# Altium project mdriver2_control.PrjPcb (part 2 of 2)

## Sheet analog.SchDoc
size A4; SheetNumber: 5; SheetTotal: 6
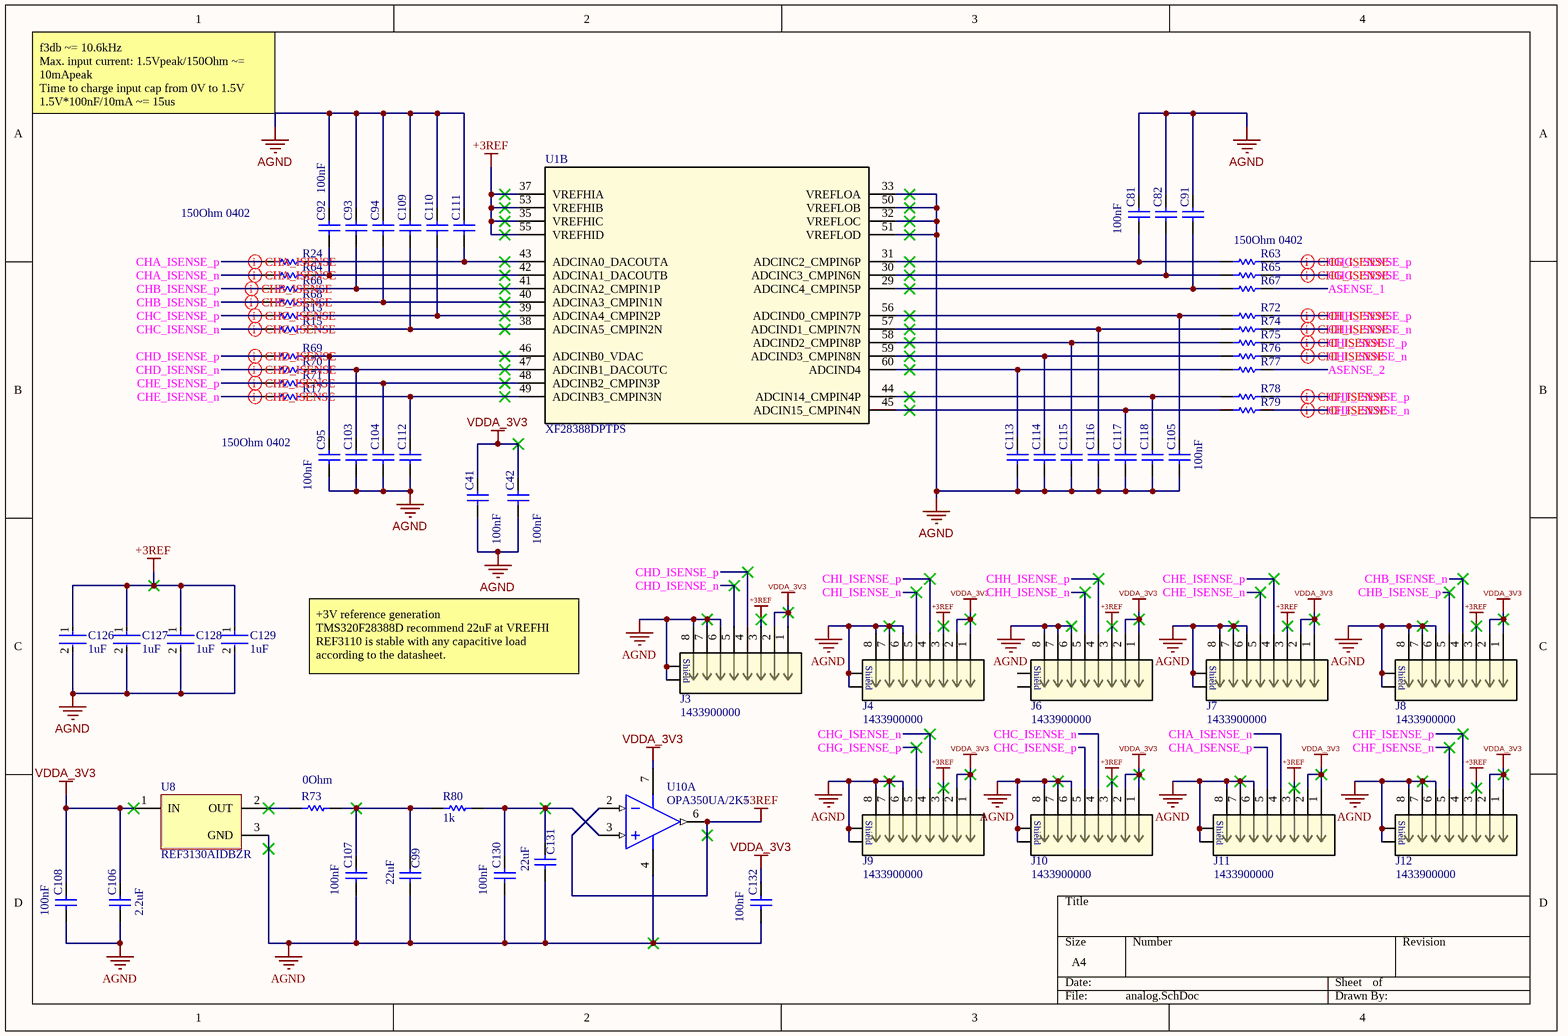
[diagram p4: analog.SchDoc]

### Parts
C41  100nF  [CAP 0402_1005]
C42  100nF  [CAP 0402_1005]
C81  100nF  [CAP 0402_1005]
C82  100nF  [CAP 0402_1005]  (value not drawn)
C91  100nF  [CAP 0402_1005]  (value not drawn)
C92  100nF  [CAP 0402_1005]
C93  100nF  [CAP 0402_1005]  (value not drawn)
C94  100nF  [CAP 0402_1005]  (value not drawn)
C95  100nF  [CAP 0402_1005]
C99  22uF  [CAP 0805_2012]
C103  100nF  [CAP 0402_1005]  (value not drawn)
C104  100nF  [CAP 0402_1005]  (value not drawn)
C105  100nF  [CAP 0402_1005]
C106  2.2uF  [CAP 0603_1608]
C107  100nF  [CAP 0402_1005]
C108  100nF  [CAP 0402_1005]
C109  100nF  [CAP 0402_1005]  (value not drawn)
C110  100nF  [CAP 0402_1005]  (value not drawn)
C111  100nF  [CAP 0402_1005]  (value not drawn)
C112  100nF  [CAP 0402_1005]  (value not drawn)
C113  100nF  [CAP 0402_1005]  (value not drawn)
C114  100nF  [CAP 0402_1005]  (value not drawn)
C115  100nF  [CAP 0402_1005]  (value not drawn)
C116  100nF  [CAP 0402_1005]  (value not drawn)
C117  100nF  [CAP 0402_1005]  (value not drawn)
C118  100nF  [CAP 0402_1005]  (value not drawn)
C126  1uF  [FP-C0402C105K8PACTU-MFG]
C127  1uF  [FP-C0402C105K8PACTU-MFG]
C128  1uF  [FP-C0402C105K8PACTU-MFG]
C129  1uF  [FP-C0402C105K8PACTU-MFG]
C130  100nF  [CAP 0402_1005]
C131  22uF  [CAP 0805_2012]
C132  100nF  [CAP 0402_1005]
J3  1433900000  [CONN8_1433900000_WED]
J4  1433900000  [CONN8_1433900000_WED]
J6  1433900000  [CONN8_1433900000_WED]
J7  1433900000  [CONN8_1433900000_WED]
J8  1433900000  [CONN8_1433900000_WED]
J9  1433900000  [CONN8_1433900000_WED]
J10  1433900000  [CONN8_1433900000_WED]
J11  1433900000  [CONN8_1433900000_WED]
J12  1433900000  [CONN8_1433900000_WED]
R13  150Ohm 0402  [RESC1005X40X25LL05T10]  (value not drawn)
R15  150Ohm 0402  [RESC1005X40X25LL05T10]  (value not drawn)
R17  150Ohm 0402  [RESC1005X40X25LL05T10]  (value not drawn)
R24  150Ohm 0402  [RESC1005X40X25LL05T10]  (value not drawn)
R63  150Ohm 0402  [RESC1005X40X25LL05T10]
R64  150Ohm 0402  [RESC1005X40X25LL05T10]
R65  150Ohm 0402  [RESC1005X40X25LL05T10]  (value not drawn)
R66  150Ohm 0402  [RESC1005X40X25LL05T10]  (value not drawn)
R67  150Ohm 0402  [RESC1005X40X25LL05T10]  (value not drawn)
R68  150Ohm 0402  [RESC1005X40X25LL05T10]  (value not drawn)
R69  150Ohm 0402  [RESC1005X40X25LL05T10]
R70  150Ohm 0402  [RESC1005X40X25LL05T10]  (value not drawn)
R71  150Ohm 0402  [RESC1005X40X25LL05T10]  (value not drawn)
R72  150Ohm 0402  [RESC1005X40X25LL05T10]  (value not drawn)
R73  0Ohm  [RES 0603_1608]
R74  150Ohm 0402  [RESC1005X40X25LL05T10]  (value not drawn)
R75  150Ohm 0402  [RESC1005X40X25LL05T10]  (value not drawn)
R76  150Ohm 0402  [RESC1005X40X25LL05T10]  (value not drawn)
R77  150Ohm 0402  [RESC1005X40X25LL05T10]  (value not drawn)
R78  150Ohm 0402  [RESC1005X40X25LL05T10]  (value not drawn)
R79  150Ohm 0402  [RESC1005X40X25LL05T10]  (value not drawn)
R80  1k  [RES 0402_1005]
U1  XF28388DPTPS  [PTP0176F-IPC_A]  (part B of 5)
U8  REF3130AIDBZR  [DBZ0003A_N]
U10  OPA350UA/2K5  [D0008A_N]  (part A of 2)

### Nets
+3REF: C126.1 C127.1 C128.1 C129.1 J3.3 J4.3 J6.3 J7.3 J8.3 J9.3 J10.3 J11.3 J12.3 U1.35(VREFHIC) U1.37(VREFHIA) U1.53(VREFHIB) U1.55(VREFHID) U10.2(IN-) U10.6(OUT)
AGND: C41.1 C42.1 C81.2 C82.2 C91.2 C92.2 C93.2 C94.2 C95.1 C99.1 C103.1 C104.1 C105.1 C106.1 C107.1 C108.1 C109.2 C110.2 C111.2 C112.1 C113.1 C114.1 C115.1 C116.1 C117.1 C118.1 C126.2 C127.2 C128.2 C129.2 C130.1 C131.1 C132.1 J3.6 J3.7 J3.8 J3.9 J3.10(SHLD) J4.6 J4.7 J4.8 J4.9 J4.10(SHLD) J6.6 J6.7 J6.8 J7.6 J7.7 J7.8 J7.9 J7.10(SHLD) J8.6 J8.7 J8.8 J8.9 J8.10(SHLD) J9.6 J9.7 J9.8 J9.9 J9.10(SHLD) J10.6 J10.7 J10.8 J10.9 J10.10(SHLD) J11.6 J11.7 J11.8 J11.9 J11.10(SHLD) J12.6 J12.7 J12.8 J12.9 J12.10(SHLD) U1.32(VREFLOC) U1.33(VREFLOA) U1.50(VREFLOB) U1.51(VREFLOD) U8.3(GND) U10.4(V-)
VDDA_3V3: C41.2 C42.2 C106.2 C108.2 C132.2 J3.1 J3.2 J4.1 J4.2 J6.1 J6.2 J7.1 J7.2 J8.1 J8.2 J9.1 J9.2 J10.1 J10.2 J11.1 J11.2 J12.1 J12.2 U8.1(IN) U10.7(V+)
ASENSE_1: R67.2
ASENSE_2: R77.2
CHA_ISENSE_n: J11.4 R64.1
CHA_ISENSE_p: J11.5 R24.1
CHB_ISENSE_n: J8.4 R68.1
CHB_ISENSE_p: J8.5 R66.1
CHC_ISENSE_n: J10.4 R15.1
CHC_ISENSE_p: J10.5 R13.1
CHD_ISENSE_n: J3.5 R70.1
CHD_ISENSE_p: J3.4 R69.1
CHE_ISENSE_n: J7.5 R17.1
CHE_ISENSE_p: J7.4 R71.1
CHF_ISENSE_n: J12.5 R79.2
CHF_ISENSE_p: J12.4 R78.2
CHG_ISENSE_n: J9.4 R65.2
CHG_ISENSE_p: J9.5 R63.2
CHH_ISENSE_n: J6.5 R74.2
CHH_ISENSE_p: J6.4 R72.2
CHI_ISENSE_n: J4.5 R76.2
CHI_ISENSE_p: J4.4 R75.2
NetC81_1: C81.1 R63.1 U1.31(ADCINC2_CMPIN6P)
NetC82_1: C82.1 R65.1 U1.30(ADCINC3_CMPIN6N)
NetC91_1: C91.1 R67.1 U1.29(ADCINC4_CMPIN5P)
NetC92_1: C92.1 R64.2 U1.42(ADCINA1_DACOUTB)
NetC93_1: C93.1 R66.2 U1.41(ADCINA2_CMPIN1P)
NetC94_1: C94.1 R68.2 U1.40(ADCINA3_CMPIN1N)
NetC95_2: C95.2 R69.2 U1.46(ADCINB0_VDAC)
NetC99_2: C99.2 C107.2 R73.2 R80.1
NetC103_2: C103.2 R70.2 U1.47(ADCINB1_DACOUTC)
NetC104_2: C104.2 R71.2 U1.48(ADCINB2_CMPIN3P)
NetC105_2: C105.2 R72.1 U1.56(ADCIND0_CMPIN7P)
NetC109_1: C109.1 R15.2 U1.38(ADCINA5_CMPIN2N)
NetC110_1: C110.1 R13.2 U1.39(ADCINA4_CMPIN2P)
NetC111_1: C111.1 R24.2 U1.43(ADCINA0_DACOUTA)
NetC112_2: C112.2 R17.2 U1.49(ADCINB3_CMPIN3N)
NetC113_2: C113.2 R77.1 U1.60(ADCIND4)
NetC114_2: C114.2 R76.1 U1.59(ADCIND3_CMPIN8N)
NetC115_2: C115.2 R75.1 U1.58(ADCIND2_CMPIN8P)
NetC116_2: C116.2 R74.1 U1.57(ADCIND1_CMPIN7N)
NetC117_2: C117.2 R79.1 U1.45(ADCIN15_CMPIN4N)
NetC118_2: C118.2 R78.1 U1.44(ADCIN14_CMPIN4P)
NetC130_2: C130.2 C131.2 R80.2 U10.3(IN+)
NetR73_1: R73.1 U8.2(OUT)

Not connected (* = marked no-connect by the designer): J6 9 10(SHLD)

### Layout directives
differential pair: CHA_ISENSE_n, CHA_ISENSE_p, CHB_ISENSE_n, CHB_ISENSE_p, CHC_ISENSE_n, CHC_ISENSE_p, CHD_ISENSE_n, CHD_ISENSE_p, CHE_ISENSE_n, CHE_ISENSE_p, CHF_ISENSE_n, CHF_ISENSE_p, CHG_ISENSE_n, CHG_ISENSE_p, CHH_ISENSE_n, CHH_ISENSE_p, CHI_ISENSE_n, CHI_ISENSE_p

### Notes on the sheet
- f3db ~= 10.6kHz
  Max. input current: 1.5Vpeak/150Ohm ~= 10mApeak
  Time to charge input cap from 0V to 1.5V
  1.5V*100nF/10mA ~= 15us
- +3V reference generation
  TMS320F28388D recommend 22uF at VREFHI
  REF3110 is stable with any capacitive load according to the datasheet.
- (in symbol 1433900000) Shield

### Library data of the parts
C41 C42 C81 C82 C91-C95 C103-C105 C107-C118 C130 C132 = Cap: MLCC 100nF 0402 10V; Published: 8-Jun-2000; LatestRevisionDate: 17-Jul-2002; LatestRevisionNote: Re-released for DXP Platform.; PackageReference: RAD-0.3; Publisher: Altium Limited; PackageDescription: Radial Cap, Thru-Hole; 2 Leads; 0.3 in Pin Spacing; Value: 100nF
  C41: Supplier: Digikey; Supplier Part Number: 445-6902-1-ND
  C81 C82 C91-C95 C103-C105 C107-C118 C130 C132: Supplier 1: Arrow Electronics; Supplier Part Number 1: C0402C104K8PACTU
C99 C131 = Cap: MLCC 22uF 0805 5V; Published: 8-Jun-2000; LatestRevisionDate: 17-Jul-2002; LatestRevisionNote: Re-released for DXP Platform.; PackageReference: RAD-0.3; Publisher: Altium Limited; PackageDescription: Radial Cap, Thru-Hole; 2 Leads; 0.3 in Pin Spacing; Value: 22uF
C106 = Cap: MLCC 2.2uF 0603 10V; Published: 8-Jun-2000; LatestRevisionDate: 17-Jul-2002; LatestRevisionNote: Re-released for DXP Platform.; PackageReference: RAD-0.3; Publisher: Altium Limited; PackageDescription: Radial Cap, Thru-Hole; 2 Leads; 0.3 in Pin Spacing; Value: 2.2uF
C126-C129 = CMP-2008-02081-2: MLCC 1uF 0402; Dielectric Material: Ceramic; Voltage Rating (DC): 10V; Dissipation Factor: 5%; Dielectric: X5R; Tolerance: 10%; Number of Pins: 2; Contact Plating: Tin; Min Operating Temperature: -55°C; Termination: SMD/SMT; Lead Free: Lead Free; Construction: Flat; Mount: Surface Mount; Series: C; Thickness: 0.022inch; Width: 0.5mm; Radiation Hardening: No; Capacitance: 1uF; Height: 0.5mm; Voltage: 10V; Length: 1mm; Depth: 0.5mm; Max Operating Temperature: 85°C; Package Quantity: 1; Packaging: Tape and Reel; RoHS Compliant: Yes; Case Code (Imperial): 0402; Case Code (Metric): 1005; REACH SVHC: No SVHC; Voltage Rating: 10V; Case/Package: 0402
J3 J4 J6-J12 = 1433900000: No Description Available; Mfr_Name: Weidmuller; RefDes: RefDes; Type: Type; Supplier 1: Digikey; Supplier Part Number 1: 281-6784-1-ND
R13 R15 R17 R24 R63-R72 R74-R79 = RES: Resistor 150Ohm 0402; Part Number: RC0402FR-07150RL; Manufacturer: Yageo / Phycomp
R73 = Res1: Resistor 0Ohm 0603; Value: 22k; Published: 8-Jun-2000; LatestRevisionDate: 17-Jul-2002; LatestRevisionNote: Re-released for DXP Platform.; PackageReference: AXIAL-0.3; Publisher: Altium Limited; PackageDescription: Axial Device, Thru-Hole; 2 Leads; 0.3 in Pin Spacing; Supplier 1: Future Electronics; Supplier Part Number 1: 3375797
R80 = Res1: Resistor 1kOhm 0402; Value: 2.2k; Published: 8-Jun-2000; LatestRevisionDate: 17-Jul-2002; LatestRevisionNote: Re-released for DXP Platform.; PackageReference: AXIAL-0.3; Publisher: Altium Limited; PackageDescription: Axial Device, Thru-Hole; 2 Leads; 0.3 in Pin Spacing; Supplier 1: Future Electronics; Supplier Part Number 1: 2136083
U1 = XF28388DPTPS: Mfr_Name: Texas Instruments; TYPE: TYPE; RefDes: RefDes
U8 = CMP-0367-00139-2: 20 ppm / degC Max, 100 uA Series Voltage Reference, -40 to 125 degC, 3-pin SOT-23 (DBZ), Green (RoHS & no Sb/Br); Manufacturer: Texas Instruments; Temp Coeff(Max)(ppm/ degree C): 20; Temp Coeff(Typ)(ppm/ degree C): 10; VO(V): 3; Rating: Catalog; Iq(Max)(uA): 100; Initial Accuracy @ 25/deg C(%): 0.2; VI(Min)(V): 3.05; VI(Max)(V): 5.5; ComponentLink1Description: Manufacturer URL; PackageDescription: 3-Pin Plastic Small Outline, Body 2.92 x 1.3 mm, Pitch 0.95 mm; ComponentLink3URL: http://www.ti.com/litv/pdf/mpds108a; ComponentLink2URL: http://www.ti.com/lit/ds/symlink/ref3130.pdf; Mounting Technology: Surface Mount; ComponentLink2Description: Datasheet; SubFamily: Series Voltage Reference; Eco-Plan: Green (RoHS & no Sb/Br); ComponentLink3Description: Package Specification; PackageReference: DBZ0003A; DatasheetVersion: SBVS046C; PartNumber: REF3130AIDBZR; ComponentLink1URL: http://www.ti.com/; PackageVersion: 4203227/B; Code_JEDEC: TO-236
U10 = CMP-0272-00632-3: High-Speed, Single-Supply, Rail-to-Rail Operational Amplifier MicroAmplifier(TM) Series, 2.7 to 5.5 V, -40 to 85 degC, 8-pin SOIC (D8), Green (RoHS & no Sb/Br); Manufacturer: Texas Instruments; Vn at 1kHz(Typ)(nV/rtHz): 18; Total Supply Voltage(Min)(+5V is 5, +/-5V is 10): 2.7; Number of Channels: 1; Sub Family: Low Input Bias Current Amp (<=10pA), Low Offset Voltage Amplifier (<=500uV), Low Supply Voltage Amplifier (<=2.7V), Precision Amplifier; Total Supply Voltage(Max)(+5V is 5, +/-5V is 10): 5.5; Iq per channel(Max)(mA): 8.5; CMRR(Min)(dB): 66; IIB(Max)(pA): 10; Slew Rate(Typ)(V/us): 22; Offset Drift(Typ)(uV/C): 4; DatasheetVersion: SBOS099C; ComponentLink3URL: http://www.ti.com/litv/pdf/msoi002j; PackageDescription: 8-Pin Plastic Small Outline, Body 4.9 x 3.9 mm, Pitch 1.27 mm; ComponentLink3Description: Package Specification; ComponentLink1Description: Manufacturer URL; ComponentLink2URL: http://www.ti.com/general/docs/lit/getliterature.tsp?genericPartNumber=OPA350&fileType=pdf; ComponentLink2Description: Datasheet; PartNumber: OPA350UA/2K5; Mounting Technology: Surface Mount; PackageReference: D0008A; ComponentLink1URL: http://www.ti.com/; Vio (25C)(Max)(mV): 1; Code_JEDEC: MS-012; Eco-Plan: Green (RoHS & no Sb/Br); PackageVersion: 4040047-3/M, 06/2011

## Sheet ethernet.SchDoc: Ethernet
size A3; ApprovedBy: dvarx; CompanyName: MSRL; DrawnBy: dvarx; Engineer: dvarx; Organization: MSRL; SheetNumber: 6; SheetTotal: 6
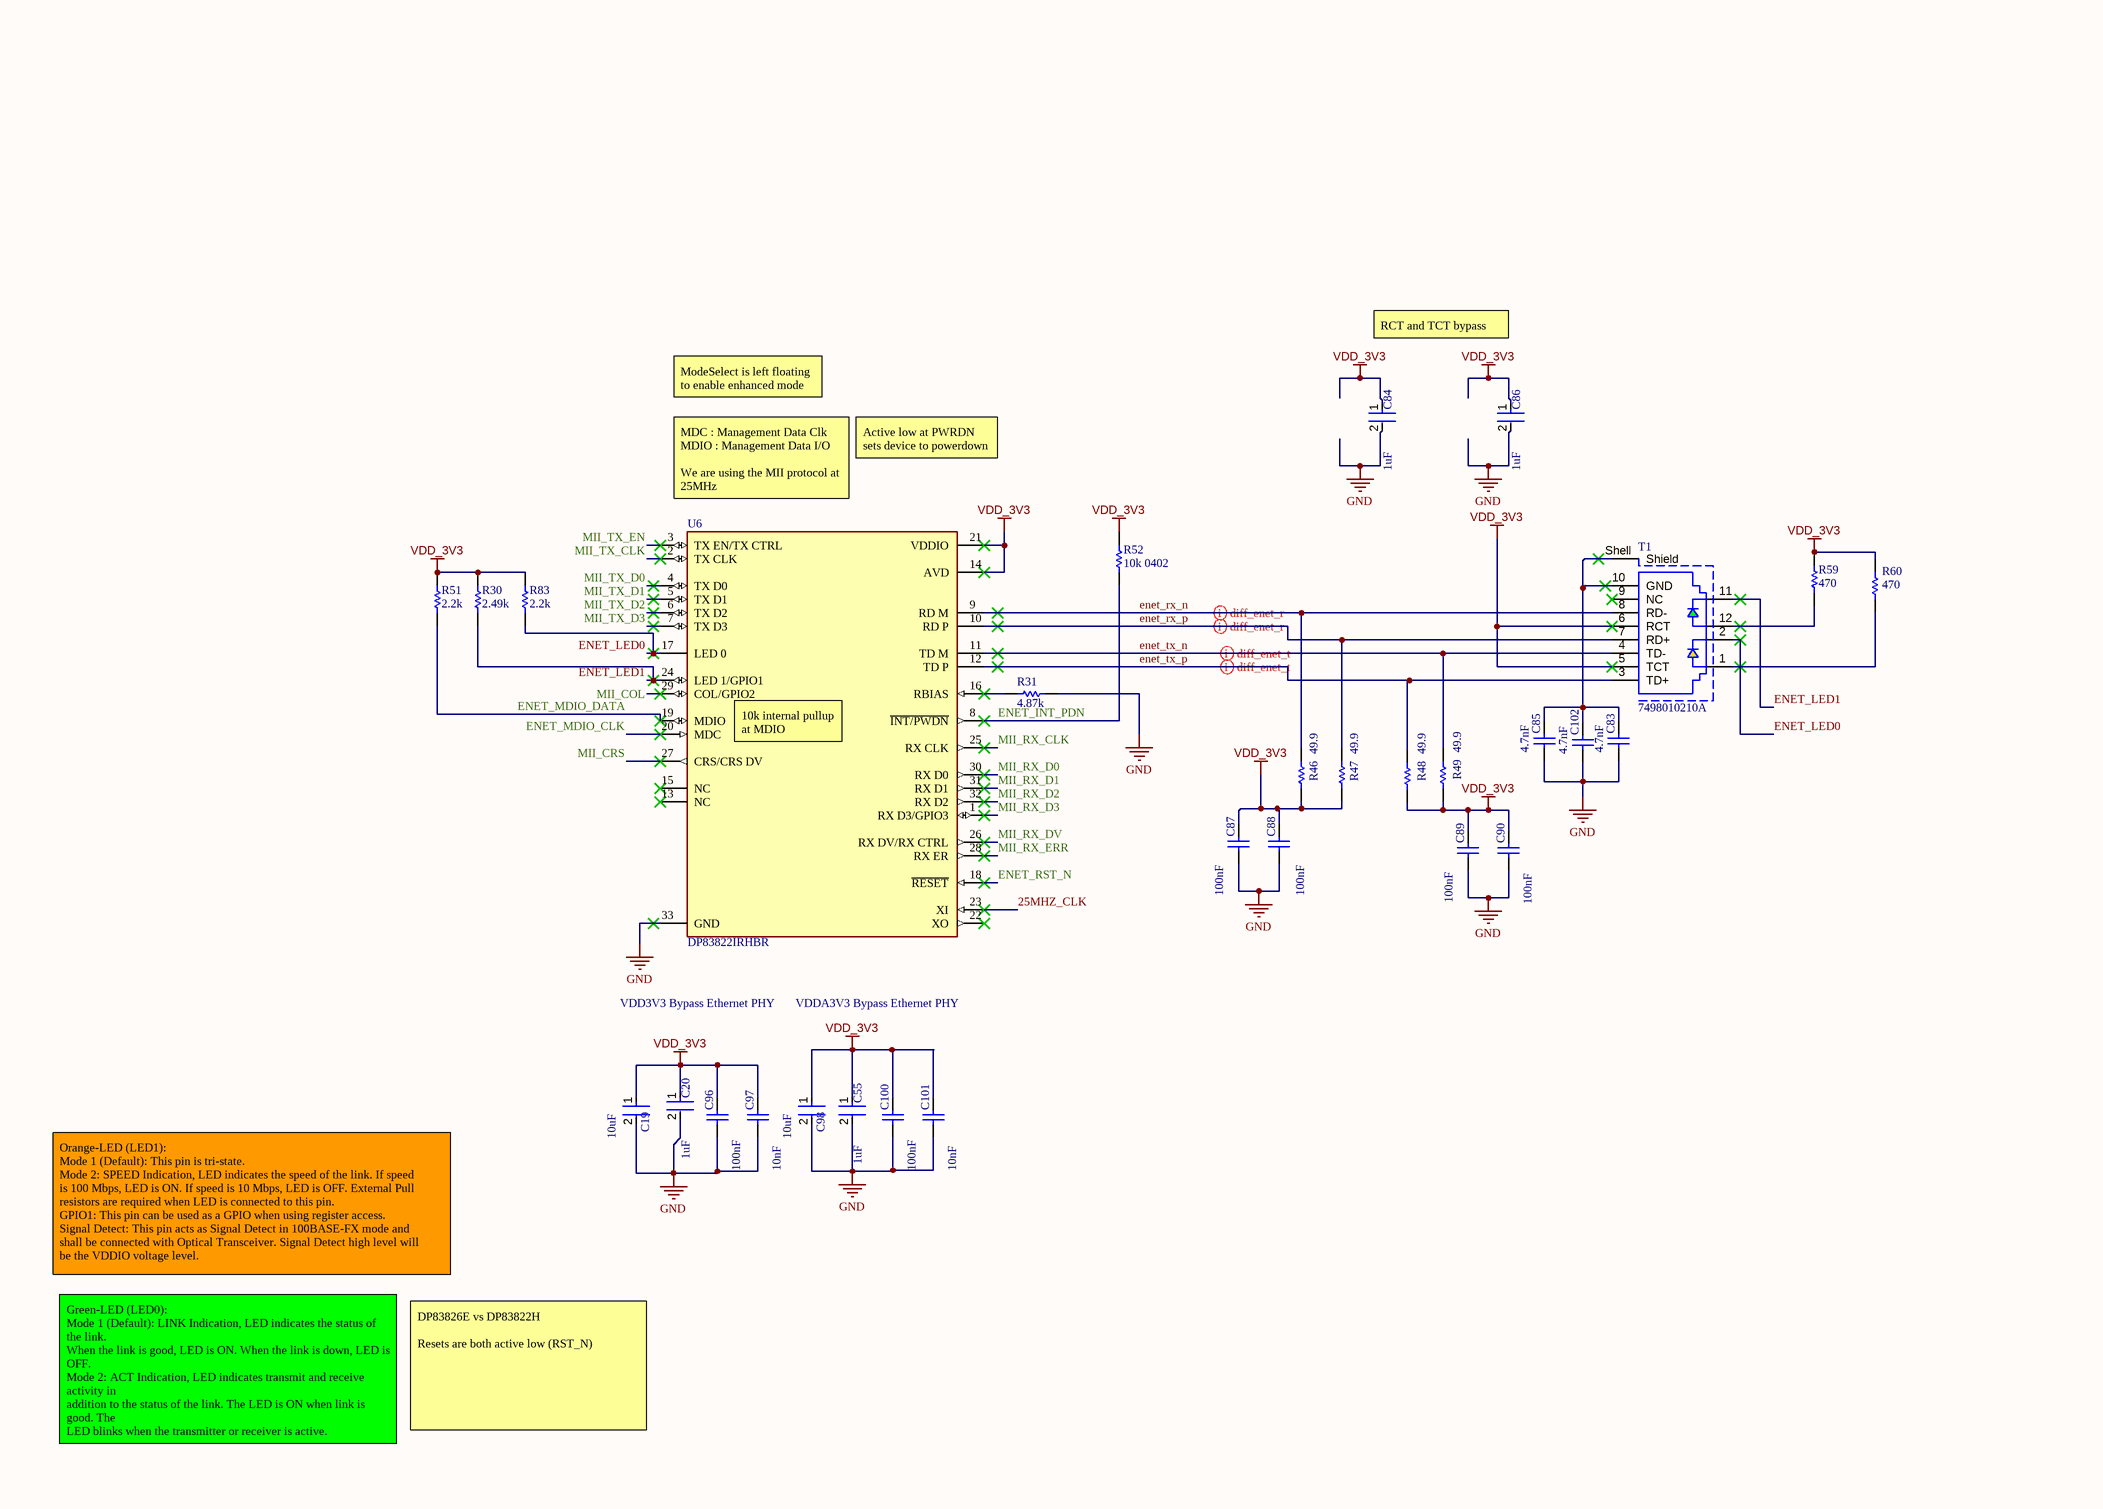
[diagram p5: ethernet.SchDoc]

### Parts
C19  10uF  [FP-CL05A106MP5NUNC-MFG]
C20  1uF  [FP-C0402C105K8PACTU-MFG]
C55  1uF  [FP-C0402C105K8PACTU-MFG]
C83  4.7nF  [CAP 0603_1608]
C84  1uF  [FP-C0402C105K8PACTU-MFG]
C85  4.7nF  [CAP 0603_1608]
C86  1uF  [FP-C0402C105K8PACTU-MFG]
C87  100nF  [CAP 0402_1005]
C88  100nF  [CAP 0402_1005]
C89  100nF  [CAP 0402_1005]
C90  100nF  [CAP 0402_1005]
C96  100nF  [CAP 0402_1005]
C97  10nF  [CAP 0402_1005]
C98  10uF  [FP-CL05A106MP5NUNC-MFG]
C100  100nF  [CAP 0402_1005]
C101  10nF  [CAP 0402_1005]
C102  4.7nF  [CAP 0603_1608]
R30  2.49k  [RES 0402_1005]
R31  4.87k  [RES 0402_1005]
R46  49.9  [RES 0402_1005]
R47  49.9  [RES 0402_1005]
R48  49.9  [RES 0402_1005]
R49  49.9  [RES 0402_1005]
R51  2.2k  [RES 0402_1005]
R52  10k 0402  [RES 0402_1005]
R59  470  [RES 0402_1005]
R60  470  [RES 0402_1005]
R83  2.2k  [RES 0402_1005]
T1  7498010210A  [7498010210A]
U6  DP83822IRHBR  [FP-RHB0032B-IPC_C]

### Nets
GND: C19.2 C20.2 C55.2 C83.1 C84.2 C85.1 C86.2 C87.1 C88.1 C89.1 C90.1 C96.1 C97.1 C98.2 C100.1 C101.1 C102.1 R31.1 U6.33(GND)  [project net AGND]
VDD_3V3: C19.1 C20.1 C55.1 C84.1 C86.1 C87.2 C88.2 C89.2 C90.2 C96.2 C97.2 C98.1 C100.2 C101.2 R30.1 R46.1 R47.1 R48.1 R49.1 R51.1 R52.2 R59.1 R60.1 R83.1 T1.5(TCT) T1.6(RCT) U6.14(AVD) U6.21(VDDIO)
25MHZ_CLK: U6.23(XI)
ENET_INT_PDN: R52.1 U6.8(~{INT/PWDN})
ENET_LED0: R83.2 T1.2 U6.17(LED_0)
ENET_LED1: R30.2 T1.11 U6.24(LED_1/GPIO1)
ENET_MDIO_CLK: U6.20(MDC)
ENET_MDIO_DATA: R51.2 U6.19(MDIO)
ENET_RST_N: U6.18(~{RESET})
enet_rx_n: R46.2 T1.8(RD-) U6.9(RD_M)
enet_rx_p: R47.2 T1.7(RD+) U6.10(RD_P)
enet_tx_n: R49.2 T1.4(TD-) U6.11(TD_M)
enet_tx_p: R48.2 T1.3(TD+) U6.12(TD_P)
MII_COL: U6.29(COL/GPIO2)
MII_CRS: U6.27(CRS/CRS_DV)
MII_RX_CLK: U6.25(RX_CLK)
MII_RX_D0: U6.30(RX_D0)
MII_RX_D1: U6.31(RX_D1)
MII_RX_D2: U6.32(RX_D2)
MII_RX_D3: U6.1(RX_D3/GPIO3)
MII_RX_DV: U6.26(RX_DV/RX_CTRL)
MII_RX_ERR: U6.28(RX_ER)
MII_TX_CLK: U6.2(TX_CLK)
MII_TX_D0: U6.4(TX_D0)
MII_TX_D1: U6.5(TX_D1)
MII_TX_D2: U6.6(TX_D2)
MII_TX_D3: U6.7(TX_D3)
MII_TX_EN: U6.3(TX_EN/TX_CTRL)
NetC83_2: C83.2 C85.2 C102.2 T1.10(GND) T1.Shell(Shield)
NetR31_2: R31.2 U6.16(RBIAS)
NetR59_2: R59.2 T1.12
NetR60_2: R60.2 T1.1

Not connected (* = marked no-connect by the designer): T1 9(NC)*; U6 13(NC)* 15(NC)* 22(XO)*

### Layout directives
differential pair; differential pair class diff_enet_tr: enet_tx_n, enet_tx_p
differential pair; differential pair class diff_enet_r: enet_rx_n, enet_rx_p

### Notes on the sheet
- RCT and TCT bypass
- ModeSelect is left floating to enable enhanced mode
- Active low at PWRDN sets device to powerdown
- (near U6) MDC : Management Data Clk
  MDIO : Management Data I/O
  We are using the MII protocol at 25MHz
- (near U6) 10k internal pullup at MDIO
- VDD3V3 Bypass Ethernet PHY
- VDDA3V3 Bypass Ethernet PHY
- Orange-LED (LED1):
  Mode 1 (Default): This pin is tri-state.
  Mode 2: SPEED Indication, LED indicates the speed of the link. If speed
  is 100 Mbps, LED is ON. If speed is 10 Mbps, LED is OFF. External Pull
  resistors are required when LED is connected to this pin.
  GPIO1: This pin can be used as a GPIO when using register access.
  Signal Detect: This pin acts as Signal Detect in 100BASE-FX mode and
  shall be connected with Optical Transceiver. Signal Detect high level will
  be the VDDIO voltage level.
- Green-LED (LED0):
  Mode 1 (Default): LINK Indication, LED indicates the status of the link.
  When the link is good, LED is ON. When the link is down, LED is OFF.
  Mode 2: ACT Indication, LED indicates transmit and receive activity in
  addition to the status of the link. The LED is ON when link is good. The
  LED blinks when the transmitter or receiver is active.
- DP83826E vs DP83822H
  Resets are both active low (RST_N)
- THIS DOCUMENT AND THE DATA DISCLOSED HEREIN OR
- HEREWITH IS THE PROPERTY OF ALTIUM LIMITED AND MAY
- DWG NO:
- REVISION
- REV:
- DESCRIPTION
- DATE
- APPROVED
- BE FREELY DISTRIBUTED IN WHOLE. NO RIGHTS ARE
- RESERVED OR EXPRESS OR IMPLIED WARANTEE GIVEN.
- ENG:
- APPROVALS
- PROJECT
- DSN:
- CHK:
- REFERENCE DOCUMENTS
- PROJECT REVISION:
- TITLE
- DOCUMENT REVISION:
- DESIGN ITEM:
- BOM:
- FAB DWG:
- PCB DWG:
- ASSY DWG:
- SCALE:
- A3
- SIZE
- CAGE CODE
- FILE NAME
- DWG NO.
- SHEET
- OF
- REV

### Library data of the parts
C19 C98 = CMP-13271-000002-1: MLCC 10uF 0402 10V; Manufacturer Part Number: CL05A106MP5NUNC; Manufacturer: Samsung; Temperature Coefficient: 15%; Tolerance: 20%; Temperature Characteristic: X5R; Material: Ceramic; Octopart: https://octopart.com/cl05a106mp5nunc-samsung-22457395; Voltage Rating: 10V; RoHS: TRUE; Value: 10uF; Height: 0.7mm; Digikey Description: CAP CER 10UF 10V X5R 0402; Automotive: No; Package: CL05A106MP5NUNC; Device Class L1: Passive Components; Capacitance: 10uF; Temperature Range High: +85°C; ComponentLink2Description: Datasheet; Device Class L2: Capacitors; Temperature: -55°C to +85°C; ComponentLink2URL: http://www.samsungsem.com/kr/support/product-search/mlcc/__icsFiles/afieldfile/2019/05/10/19-CL05A106MP5NUNC.pdf; Device Class L3: Ceramic Capacitors; Category: Cap; Temperature Range Low: -55°C; Ipc Land Pattern Name: CAPC10050X50; Lead Free: Yes
C20 C55 C84 C86 = CMP-2008-02081-2: MLCC 1uF 0402 10V; Dielectric Material: Ceramic; Dissipation Factor: 5%; Dielectric: X5R; Tolerance: 10%; Number of Pins: 2; Contact Plating: Tin; Min Operating Temperature: -55°C; Termination: SMD/SMT; Lead Free: Lead Free; Construction: Flat; Voltage Rating (DC): 10V; Mount: Surface Mount; Series: C; Thickness: 0.022inch; Width: 0.5mm; Radiation Hardening: No; Capacitance: 1uF; Height: 0.5mm; Voltage: 10V; Length: 1mm; Depth: 0.5mm; Max Operating Temperature: 85°C; Package Quantity: 1; Packaging: Tape and Reel; RoHS Compliant: Yes; Case Code (Imperial): 0402; Case Code (Metric): 1005; REACH SVHC: No SVHC; Voltage Rating: 10V; Case/Package: 0402
C83 C85 C102 = Cap: MLCC 4.7nF 0603 10V; Published: 8-Jun-2000; LatestRevisionDate: 17-Jul-2002; LatestRevisionNote: Re-released for DXP Platform.; PackageReference: RAD-0.3; Publisher: Altium Limited; PackageDescription: Radial Cap, Thru-Hole; 2 Leads; 0.3 in Pin Spacing; Value: 4.7nF
C87-C90 C96 C100 = Cap: MLCC 100nF 0402 10V; Published: 8-Jun-2000; LatestRevisionDate: 17-Jul-2002; LatestRevisionNote: Re-released for DXP Platform.; PackageReference: RAD-0.3; Publisher: Altium Limited; PackageDescription: Radial Cap, Thru-Hole; 2 Leads; 0.3 in Pin Spacing; Value: 100nF
C97 C101 = Cap: MLCC 10nF 0402 5V; Value: 100nF; Published: 8-Jun-2000; LatestRevisionDate: 17-Jul-2002; LatestRevisionNote: Re-released for DXP Platform.; PackageReference: RAD-0.3; Publisher: Altium Limited; PackageDescription: Radial Cap, Thru-Hole; 2 Leads; 0.3 in Pin Spacing
R30 = Res1: Resistor 2.49kOhm 0402 1%; Published: 8-Jun-2000; LatestRevisionDate: 17-Jul-2002; LatestRevisionNote: Re-released for DXP Platform.; PackageReference: AXIAL-0.3; Publisher: Altium Limited; PackageDescription: Axial Device, Thru-Hole; 2 Leads; 0.3 in Pin Spacing; Value: 2.49k; Supplier 1: Mouser; Supplier Part Number 1: 71-CRCW0402-2.49K-E3
R31 = Res1: Resistor 4.87kOhm 0402 1%; Published: 8-Jun-2000; LatestRevisionDate: 17-Jul-2002; LatestRevisionNote: Re-released for DXP Platform.; PackageReference: AXIAL-0.3; Publisher: Altium Limited; PackageDescription: Axial Device, Thru-Hole; 2 Leads; 0.3 in Pin Spacing; Value: 4.87k; Supplier 1: Mouser; Supplier Part Number 1: 71-CRCW0402-4.87K-E3
R46-R49 = Res1: Resistor 49.9Ohm 0402; Published: 8-Jun-2000; LatestRevisionDate: 17-Jul-2002; LatestRevisionNote: Re-released for DXP Platform.; PackageReference: AXIAL-0.3; Publisher: Altium Limited; PackageDescription: Axial Device, Thru-Hole; 2 Leads; 0.3 in Pin Spacing; Value: 49.9
R51 R83 = Res1: Resistor 2.2kOhm 0402; Published: 8-Jun-2000; LatestRevisionDate: 17-Jul-2002; LatestRevisionNote: Re-released for DXP Platform.; PackageReference: AXIAL-0.3; Publisher: Altium Limited; PackageDescription: Axial Device, Thru-Hole; 2 Leads; 0.3 in Pin Spacing; Value: 2.2k
R52 = Res1: Resistor 10kOhm 0402; Published: 8-Jun-2000; LatestRevisionDate: 17-Jul-2002; LatestRevisionNote: Re-released for DXP Platform.; PackageReference: AXIAL-0.3; Publisher: Altium Limited; PackageDescription: Axial Device, Thru-Hole; 2 Leads; 0.3 in Pin Spacing; Value: 10k
R59 R60 = Res1: Resistor 470Ohm 0603; Value: 2.2k; Published: 8-Jun-2000; LatestRevisionDate: 17-Jul-2002; LatestRevisionNote: Re-released for DXP Platform.; PackageReference: AXIAL-0.3; Publisher: Altium Limited; PackageDescription: Axial Device, Thru-Hole; 2 Leads; 0.3 in Pin Spacing
T1 = CMP-03913-78125990-2: 7498010210A Telecom and Datacom Connector, 8 Contact(s), Female, Right Angle, Surface Mount Terminal; Color: Silver; Connector Type: Socket; Insertion Loss (dB): -1dB; Inductance: 350µH; Length: 25.4mm; Contact Material: Gold; Height: 13.61mm; Width: 16.1mm; Min Operating Temperature: -40°C; Max Operating Temperature: 85°C; RoHS: Non-Compliant; NexarPartId: 78125990; Case/Package: Metal
U6 = CMP-04874-000006-1: IC INTERFACE SPECIALIZED 32VQFN; Cable Length: 150m; Data Rate: 100Kbps; Max Operating Temperature: 85°C; Min Operating Temperature: -40°C; Packaging: Tape and Reel; Case/Package: VQFN; Lead Free: Lead Free; Mount: Surface Mount; RoHS Compliant: Yes

## Nets that join several sheets
AGND: mcu (61 pins), power (68 pins), auxiliary (19 pins), usb (13 pins), analog (82 pins), ethernet (19 pins)
VDD_1V2: power (25 pins), auxiliary (U4.3)
VDD_3V3: mcu (14 pins), power (55 pins), auxiliary (15 pins), usb (C57.2 C58.2 C59.1 U5.4), ethernet (28 pins)
VDDA_3V3: mcu (P4.13 P4.14 P4.15), power (5 pins), analog (25 pins)
25MHZ_CLK: auxiliary (R2.1 R32.2 U1.123), ethernet (U6.23)
ASENSE_1: mcu (P4.16), analog (R67.2)
ASENSE_2: mcu (P4.20), analog (R77.2)
BOOT_MODE_0: mcu (U1.154), auxiliary (R25.1 R27.2)
BOOT_MODE_1: mcu (U1.139), auxiliary (R26.1 R28.2)
ENET_INT_PDN: mcu (U1.133), ethernet (R52.1 U6.8)
ENET_MDIO_CLK: mcu (U1.130), ethernet (U6.20)
ENET_MDIO_DATA: mcu (U1.131), ethernet (R51.2 U6.19)
ENET_RST_N: mcu (U1.132), ethernet (U6.18)
MII_COL: mcu (U1.89), ethernet (U6.29)
MII_CRS: mcu (U1.87), ethernet (U6.27)
MII_RX_CLK: mcu (U1.93), ethernet (U6.25)
MII_RX_D0: mcu (U1.96), ethernet (U6.30)
MII_RX_D1: mcu (U1.97), ethernet (U6.31)
MII_RX_D2: mcu (U1.98), ethernet (U6.32)
MII_RX_D3: mcu (U1.100), ethernet (U6.1)
MII_RX_DV: mcu (U1.94), ethernet (U6.26)
MII_RX_ERR: mcu (U1.95), ethernet (U6.28)
MII_TX_CLK: mcu (U1.113), ethernet (U6.2)
MII_TX_D0: mcu (U1.104), ethernet (U6.4)
MII_TX_D1: mcu (U1.105), ethernet (U6.5)
MII_TX_D2: mcu (U1.107), ethernet (U6.6)
MII_TX_D3: mcu (U1.108), ethernet (U6.7)
MII_TX_EN: mcu (U1.101), ethernet (U6.3)
SCIA_UART_RX: mcu (U1.64), usb (U5.7)
SCIA_UART_TX: mcu (U1.65), usb (U5.10)

## Assembly variants
vbase: all parts fitted